# EAGLE design hat_v2 (EAGLE 7.7.0)
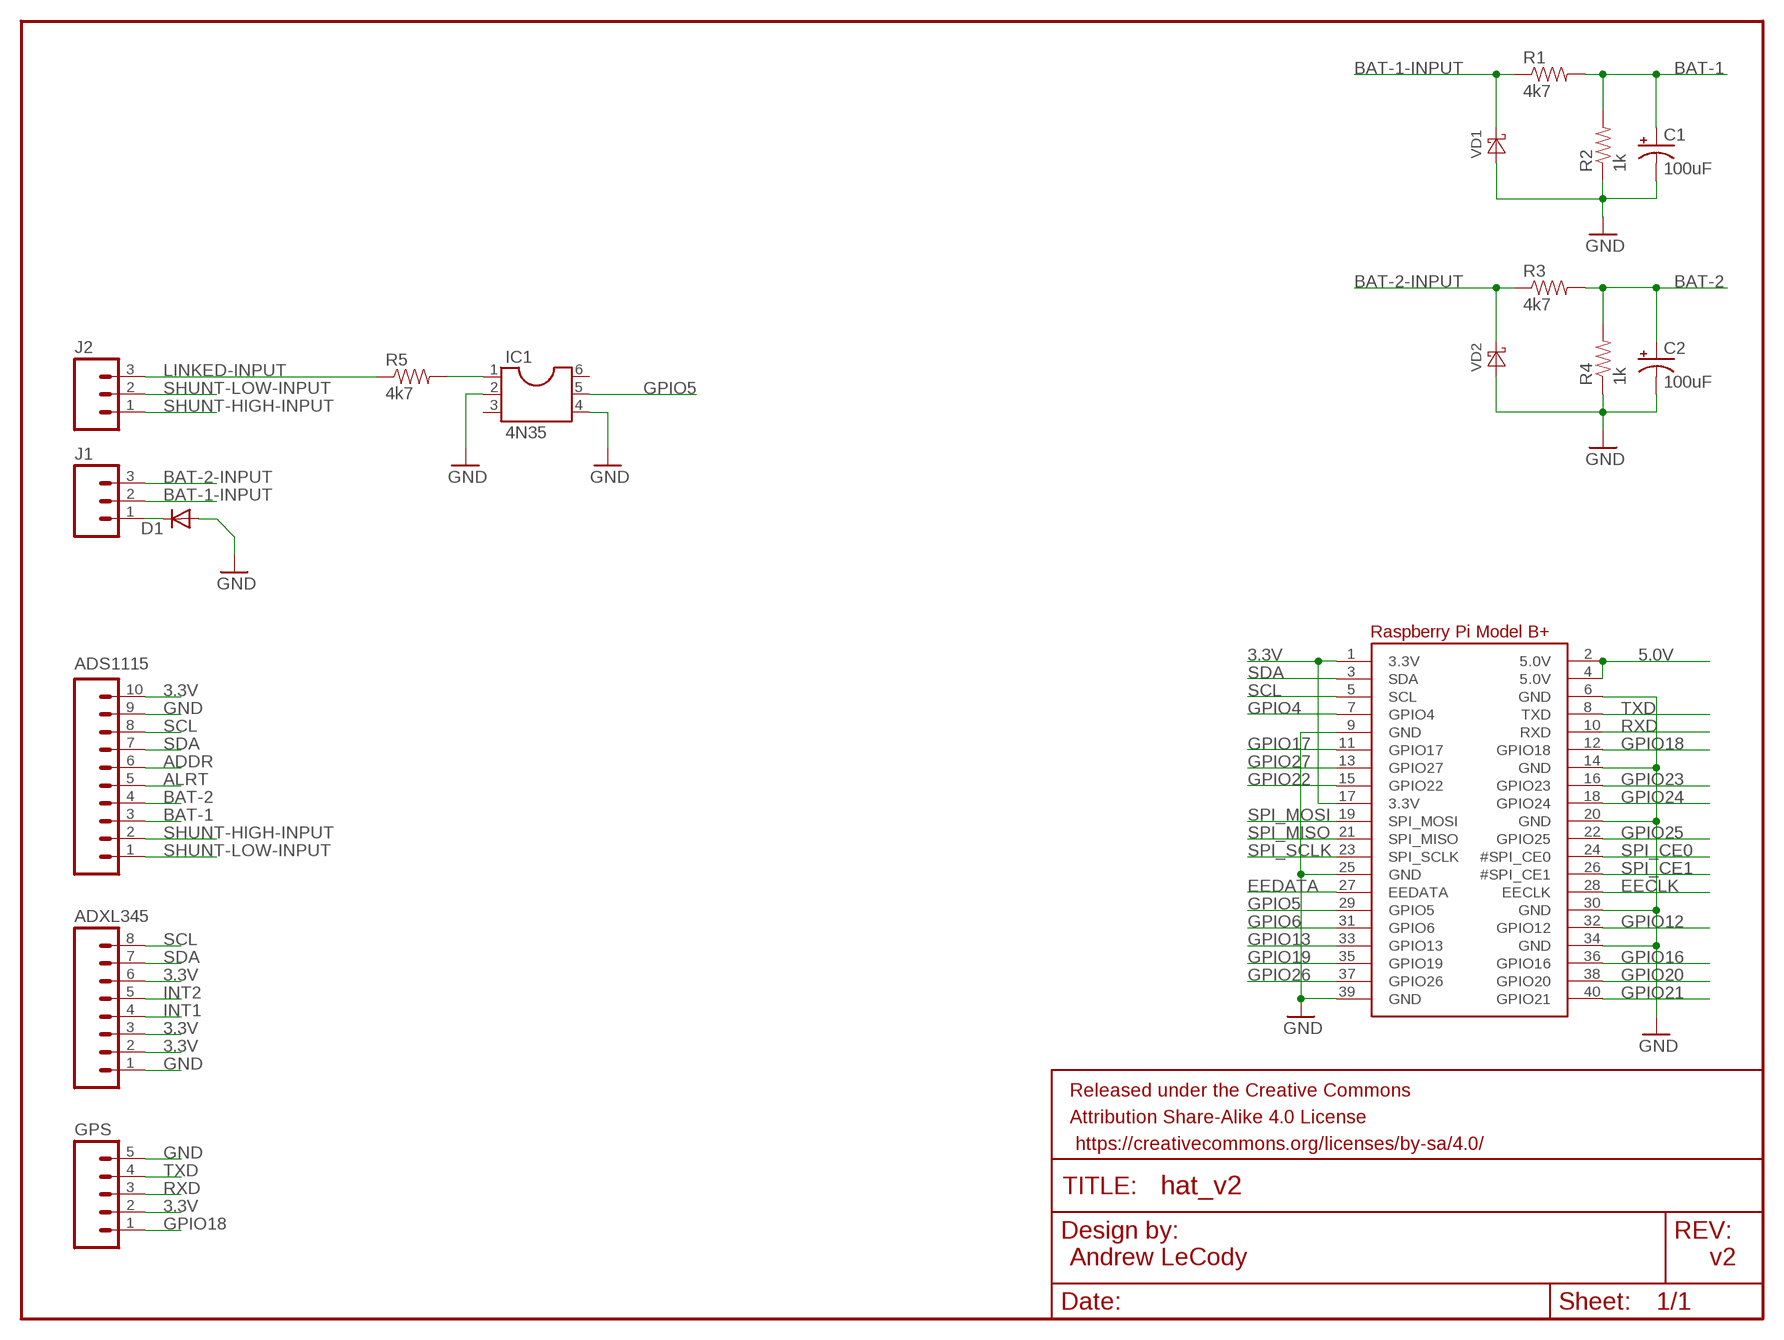
[diagram p0: schematic, sheet 1]

## Parts
ADS1115  M10SILK_FEMALE_PTH  [1X10]
ADXL345  M08SILK_FEMALE_PTH  [1X08]
C1  100uF  CAP_POLPTH1  [CPOL-RADIAL-100UF-25V]
C2  100uF  CAP_POLPTH1  [CPOL-RADIAL-100UF-25V]
D1  DIODE-DO41-10  [DO41-10]
FRAME1  FRAME-LETTER  [CREATIVE_COMMONS]
GPS  M05PTH  [1X05]
IC1  4N35  DIL6  [DIL06]
J1  M03-SCREW-5MM  [SCREWTERMINAL-5MM-3]
J2  M03-SCREW-5MM  [SCREWTERMINAL-5MM-3]
R1  4k7  RESISTORAXIAL-0.3  [AXIAL-0.3]
R2  1k  RESISTORAXIAL-0.3  [AXIAL-0.3]
R3  4k7  RESISTORAXIAL-0.3  [AXIAL-0.3]
R4  1k  RESISTORAXIAL-0.3  [AXIAL-0.3]
R5  4k7  RESISTORAXIAL-0.3  [AXIAL-0.3]
RPI1  RASPBERRYPI_BPLUS_HATNOSLOTS  [PI_HAT_NOSLOTS]
VD1  DIODE-SCHOTTKY-DO201AD  [DO201AD]
VD2  DIODE-SCHOTTKY-DO201AD  [DO201AD]

## Nets
3.3V: ADS1115.10 ADXL345.2 ADXL345.3 ADXL345.6 GPS.2 RPI1.1(3.3V) RPI1.17(3.3V)
5.0V: RPI1.2(5.0V) RPI1.4(5.0V)
ADDR: ADS1115.6
ALRT: ADS1115.5
BAT-1: ADS1115.3 C1.1(+) R1.P$2 R2.P$2
BAT-1-INPUT: J1.2 R1.P$1 VD1.C
BAT-2: ADS1115.4 C2.1(+) R3.P$2 R4.P$2
BAT-2-INPUT: J1.3 R3.P$1 VD2.C
EECLK: RPI1.28(EECLK)
EEDATA: RPI1.27(EEDATA)
GND: ADS1115.9 ADXL345.1 C1.2(-) C2.2(-) D1.A GPS.5 IC1.2 IC1.4 R2.P$1 R4.P$1 RPI1.6(GND) RPI1.9(GND) RPI1.14(GND) RPI1.20(GND) RPI1.25(GND) RPI1.30(GND) RPI1.34(GND) RPI1.39(GND) VD1.A VD2.A
GPIO4: RPI1.7(GPIO4)
GPIO5: IC1.5 RPI1.29(GPIO5)
GPIO6: RPI1.31(GPIO6)
GPIO12: RPI1.32(GPIO12)
GPIO13: RPI1.33(GPIO13)
GPIO16: RPI1.36(GPIO16)
GPIO17: RPI1.11(GPIO17)
GPIO18: GPS.1 RPI1.12(GPIO18)
GPIO19: RPI1.35(GPIO19)
GPIO20: RPI1.38(GPIO20)
GPIO21: RPI1.40(GPIO21)
GPIO22: RPI1.15(GPIO22)
GPIO23: RPI1.16(GPIO23)
GPIO24: RPI1.18(GPIO24)
GPIO25: RPI1.22(GPIO25)
GPIO26: RPI1.37(GPIO26)
GPIO27: RPI1.13(GPIO27)
INT1: ADXL345.4
INT2: ADXL345.5
LINKED-INPUT: J2.3 R5.P$1
N$1: D1.C J1.1
N$3: IC1.1 R5.P$2
RXD: GPS.3 RPI1.10(RXD)
SCL: ADS1115.8 ADXL345.8 RPI1.5(SCL)
SDA: ADS1115.7 ADXL345.7 RPI1.3(SDA)
SHUNT-HIGH-INPUT: ADS1115.2 J2.1
SHUNT-LOW-INPUT: ADS1115.1 J2.2
SPI_CE0: RPI1.24(#SPI_CE0)
SPI_CE1: RPI1.26(#SPI_CE1)
SPI_MISO: RPI1.21(SPI_MISO)
SPI_MOSI: RPI1.19(SPI_MOSI)
SPI_SCLK: RPI1.23(SPI_SCLK)
TXD: GPS.4 RPI1.8(TXD)
Unconnected: IC1.3 IC1.6

## Notes on the sheet
- Andrew LeCody | v2

## Library data of the parts
ADS1115 = SparkFun-Connectors:M10: Header 10 Standard 10-pin 0.1" header. Use with straight break away headers (SKU : PRT-00116), right angle break away headers (PRT-00553), swiss pins (PRT-00743), machine pins (PRT-00117), and female headers (PRT-00115).; PROD_ID: CONN-11563
ADXL345 = SparkFun-Connectors:M08: Header 8 Standard 8-pin 0.1" header. Use with straight break away headers (SKU : PRT-00116), right angle break away headers (PRT-00553), swiss pins (PRT-00743), machine pins (PRT-00117), and female headers (PRT-00115).; PROD_ID: CONN-08438
C1 C2 = SparkFun-Passives:CAP_POL: Capacitor Polarized These are standard SMD and PTH capacitors. Normally 10uF, 47uF, and 100uF in electrolytic and tantalum varieties. Always verify the external diameter of the through hole cap, it varies with capacity, voltage, and manufacturer. The EIA devices should be standard.
D1 = diode:DIODE-: DIODE
FRAME1 = SparkFun-Aesthetics:FRAME-LETTER: Schematic Frame Standard 8.5x11 US Letter frame
GPS = SparkFun-Connectors:M05: Header 5 Standard 5-pin 0.1" header. Use with straight break away headers (SKU : PRT-00116), right angle break away headers (PRT-00553), swiss pins (PRT-00743), machine pins (PRT-00117), and female headers (PRT-00115). Molex polarized connector foot print use with SKU : PRT-08230 with associated crimp pins and housings.
IC1 = ic-package:DIL6: Dual In Line / Socket
J1 J2 = SparkFun-Connectors:M03: Header 3 Standard 3-pin 0.1" header. Use with straight break away headers (SKU : PRT-00116), right angle break away headers (PRT-00553), swiss pins (PRT-00743), machine pins (PRT-00117), and female headers (PRT-00115). Molex polarized connector foot print use with SKU : PRT-08232 with associated crimp pins and housings.; STOREFRONT_ID: PRT-08433
R1-R5 = SparkFun-Passives:RESISTOR: Resistor Basic schematic elements and footprints for 0603, 1206, and PTH resistors.
RPI1 = microbuilder:RASPBERRYPI_BPLUS
VD1 VD2 = diode:DIODE-SCHOTTKY-: SCHOTTKY DIODE

## Board
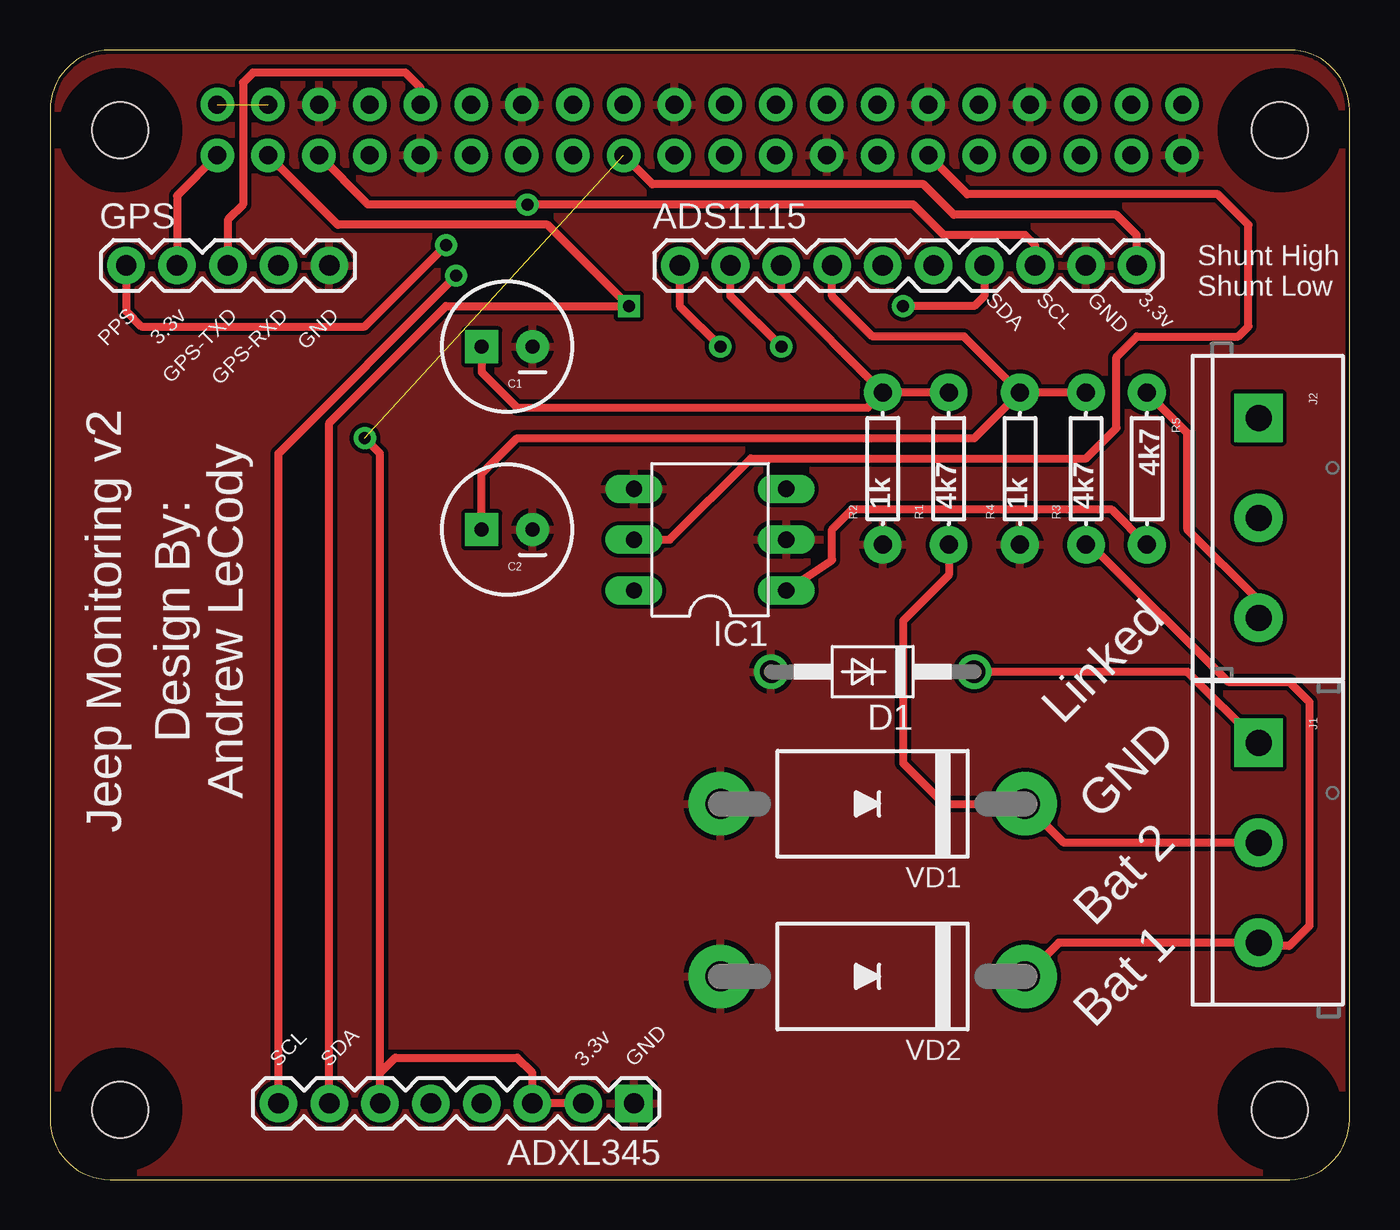
[diagram p1: board, top side]
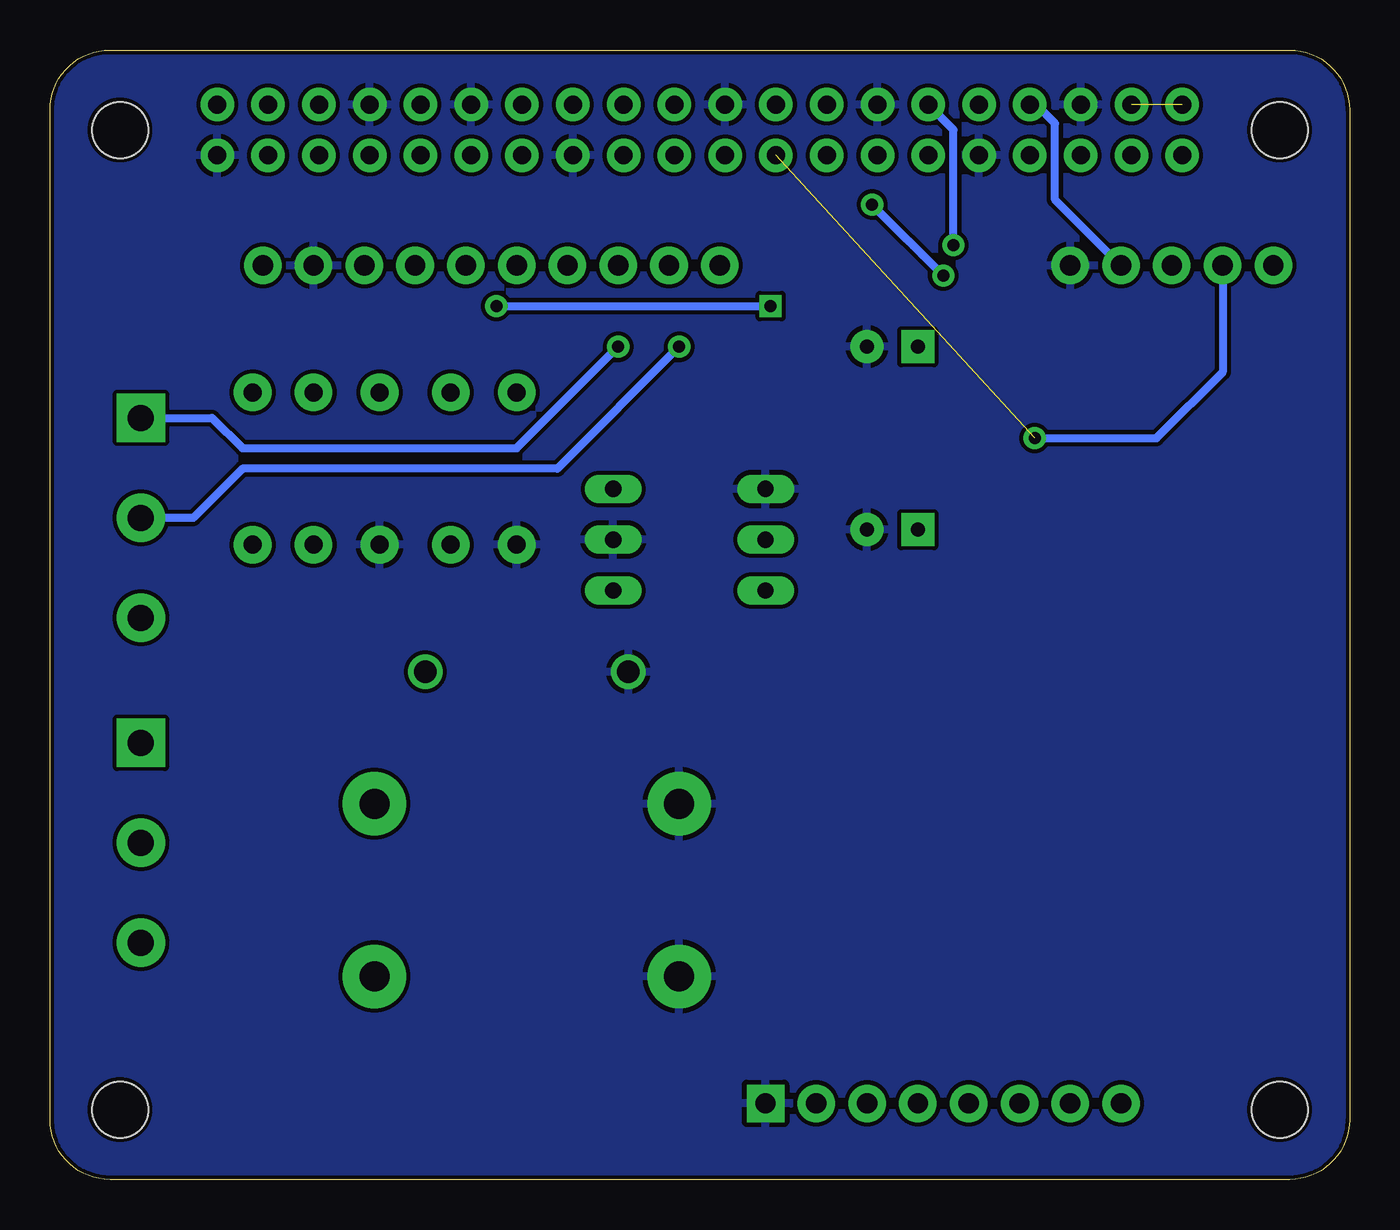
[diagram p2: board, bottom side, seen from below]

Size 65 x 56.5 mm. Coordinates in mm from the lower left corner, seen from the top.
Copper layers (1*16): Top 0.035mm / dielectric 1.5mm / Bottom 0.035mm
Design rules "SparkFun": minimum track width 8mil, minimum drill 20mil, track to track 8mil, track to pad 8mil, pad to pad 8mil, via to via 8mil, smd to smd 8mil, copper to edge 8mil, drill to drill 8mil, minimum pad ring 12mil, minimum via ring 10mil, stop-mask expansion 4mil, vias tented up to drill 20mil, thermal gap 10mil

### Footprints (pad centres in the part's own frame; a part is rotated, then mirrored left to right if it is on the bottom)
1X10 = drill 1.016 pad 1.88: 1 0,0; 2 2.54,0; 3 5.08,0; 4 7.62,0; 5 10.16,0; 6 12.7,0; 7 15.24,0; 8 17.78,0; 9 20.32,0; 10 22.86,0
1X08 = drill 1.016 pad 1.88 square: 1 0,0 | drill 1.016 pad 1.88: 2 2.54,0; 3 5.08,0; 4 7.62,0; 5 10.16,0; 6 12.7,0; 7 15.24,0; 8 17.78,0
CPOL-RADIAL-100UF-25V = drill 0.7 pad 1.651 square: 1 1.27,0 | drill 0.7 pad 1.651: 2 -1.27,0
DO41-10 = drill 1.118: A 5.08,0; C -5.08,0
1X05 = drill 1.016 pad 1.88: 1 0,0; 2 2.54,0; 3 5.08,0; 4 7.62,0; 5 10.16,0
DIL06 = drill 0.813 long: 1 -2.54,-3.81; 2 0,-3.81; 3 2.54,-3.81; 4 2.54,3.81; 5 0,3.81; 6 -2.54,3.81
SCREWTERMINAL-5MM-3 = drill 1.3 pad 2.413 square: 1 0,0 | drill 1.3 pad 2.413: 2 5,0; 3 10,0
AXIAL-0.3 = drill 0.9 pad 1.88: P$1 -3.81,0; P$2 3.81,0
PI_HAT_NOSLOTS = drill 0.9 pad 1.676: 1 8.37,51.23; 2 8.37,53.77; 3 10.91,51.23; 4 10.91,53.77; 5 13.45,51.23; 6 13.45,53.77; 7 15.99,51.23; 8 15.99,53.77; 9 18.53,51.23; 10 18.53,53.77; 11 21.07,51.23; 12 21.07,53.77; 13 23.61,51.23; 14 23.61,53.77; 15 26.15,51.23; 16 26.15,53.77; 17 28.69,51.23; 18 28.69,53.77; 19 31.23,51.23; 20 31.23,53.77; 21 33.77,51.23; 22 33.77,53.77; 23 36.31,51.23; 24 36.31,53.77; 25 38.85,51.23; 26 38.85,53.77; 27 41.39,51.23; 28 41.39,53.77; 29 43.93,51.23; 30 43.93,53.77; 31 46.47,51.23; 32 46.47,53.77; 33 49.01,51.23; 34 49.01,53.77; 35 51.55,51.23; 36 51.55,53.77; 37 54.09,51.23; 38 54.09,53.77; 39 56.63,51.23; 40 56.63,53.77 | hole 2.8: 3.5,3.5; 3.5,52.5; 61.5,52.5; 61.5,3.5
DO201AD = drill 1.499 pad 3.175: A 7.62,0; C -7.62,0

### Placement (x,y rotation side)
ADS1115  31.5,45.72 0 top
ADXL345  29.21,3.81 180 top
C1  22.86,41.66 180 top
C2  22.86,32.51 180 top
D1  41.15,25.4 180 top
FRAME1  2.54,-8.89 0 top  (outside the outline)
GPS  3.81,45.72 0 top
IC1  33.02,32 90 top
J1  60.45,21.84 270 top
J2  60.45,38.1 270 top
R1  44.96,35.56 90 top
R2  41.66,35.56 90 top
R3  51.82,35.56 90 top
R4  48.51,35.56 90 top
R5  54.86,35.56 270 top
RPI1  0,0 0 top
VD1  41.15,18.8 180 top
VD2  41.15,10.16 180 top

### Tracks (layer width: path | path; a pad name or v marks a point on that pad's centre or on a via)
3.3V  (via drill 0.6 pad 0.41)  (1 unrouted)
  Top 0.406: ADS1115.10 54.36,47.24 53.34,48.26 45.21,48.26 43.69,49.78 30.14,49.78 RPI1.17 | RPI1.1 6.35,49.21 GPS.2 | ADXL345.2 ADXL345.3 24.13,5.33 23.37,6.1 17.27,6.1 16.51,5.33 ADXL345.6 16.51,36.32 v15.75,37.08
  Bottom 0.406: v15.75,37.08 9.65,37.08 6.35,40.39 GPS.2
5.0V  (1 unrouted)
BAT-1
  Top 0.406: R1.P$2 R2.P$2 | R2.P$2 36.58,44.45 ADS1115.3 | C1.1 21.59,40.39 23.37,38.61 40.89,38.61 R2.P$2
BAT-1-INPUT
  Top 0.406: J1.2 50.72,16.84 VD1.C 44.7,18.8 42.67,20.83 42.67,27.94 44.96,30.23 R1.P$1
BAT-2
  Top 0.406: R3.P$2 R4.P$2 | R4.P$2 45.72,42.16 41.15,42.16 39.12,44.2 ADS1115.4 | C2.1 21.59,35.31 23.37,37.08 46.23,37.08 R4.P$2
BAT-2-INPUT
  Top 0.406: VD2.C 50.45,11.84 J1.3 60.61,11.68 61.98,11.68 62.99,12.7 62.99,23.88 61.98,24.89 58.93,24.89 52.07,31.75 R3.P$1
GND
  pour Bottom: 66.04,-1.27 66.04,57.15 -1.27,57.15 -1.27,-1.27
  pour Top: -1.27,57.15 66.04,57.15 66.04,-1.27 -1.27,-1.27
GPIO5
  Top 0.406: IC1.5 30.99,32 35.05,36.07 51.82,36.07 53.34,37.59 53.34,41.15 54.36,42.16 59.44,42.16 59.94,42.67 59.94,47.75 58.42,49.28 45.88,49.28 RPI1.29
GPIO18  (via drill 0.6 pad 0.41)
  Top 0.406: GPS.1 3.81,43.43 4.57,42.67 15.75,42.67 v19.81,46.74
  Bottom 0.406: v19.81,46.74 19.81,52.51 RPI1.12
LINKED-INPUT
  Top 0.406: J2.3 60.45,28.96 56.9,32.51 56.9,37.34 R5.P$1
N$1
  Top 0.406: J1.1 56.9,25.4 D1.C
N$3
  Top 0.406: IC1.1 39.12,30.99 39.12,32.51 40.13,33.53 53.09,33.53 R5.P$2
RXD
  Top 0.406: RPI1.10 18.53,54.62 17.78,55.37 10.16,55.37 9.65,54.86 9.65,48.77 8.89,48.01 GPS.3
SCL  (via drill 0.6 pad 0.41)
  Top 0.406: ADS1115.8 49.28,46.74 48.77,47.24 44.7,47.24 43.18,48.77 v23.88,48.77 15.91,48.77 RPI1.5 | ADXL345.8 11.43,36.32 v20.32,45.21
  Bottom 0.406: v20.32,45.21 v23.88,48.77
SDA  (via drill 0.6 pad 0.41)
  Top 0.406: ADS1115.7 46.74,44.2 46.23,43.69 v42.67,43.69 | RPI1.3 14.39,47.75 24.89,47.75 v28.96,43.69 19.81,43.69 13.97,37.85 ADXL345.7
  Bottom 0.406: v42.67,43.69 v28.96,43.69
SHUNT-HIGH-INPUT  (via drill 0.6 pad 0.41)
  Top 0.406: v36.58,41.66 34.04,44.2 ADS1115.2
  Bottom 0.406: J2.1 56.9,38.1 55.37,36.58 41.66,36.58 v36.58,41.66
SHUNT-LOW-INPUT  (via drill 0.6 pad 0.41)
  Top 0.406: ADS1115.1 31.5,43.69 v33.53,41.66
  Bottom 0.406: v33.53,41.66 39.62,35.56 55.37,35.56 57.83,33.1 J2.2
TXD
  Bottom 0.406: GPS.4 14.73,49.02 14.73,52.83 15.67,53.77 RPI1.8

### Text on the board
tPlace: Shunt High / Shunt Low | Jeep Monitoring v2 | Design By: / Andrew LeCody | Linked | GND | Bat 2 | Bat 1
tNames: PPS | 3.3v | GPS-TXD | GPS-RXD | GND | SDA | SCL | GND | 3.3v | SCL | SDA | 3.3v | GND
tDocu: Andrew LeCody